# EasyEDA schematic schematic.json
TITLE: Portfolio Card; REV: 1.0; Date: 2025-05-03; Sheet: 1/1; Drawn By: Nico Brooks; Company: Nico Brooks
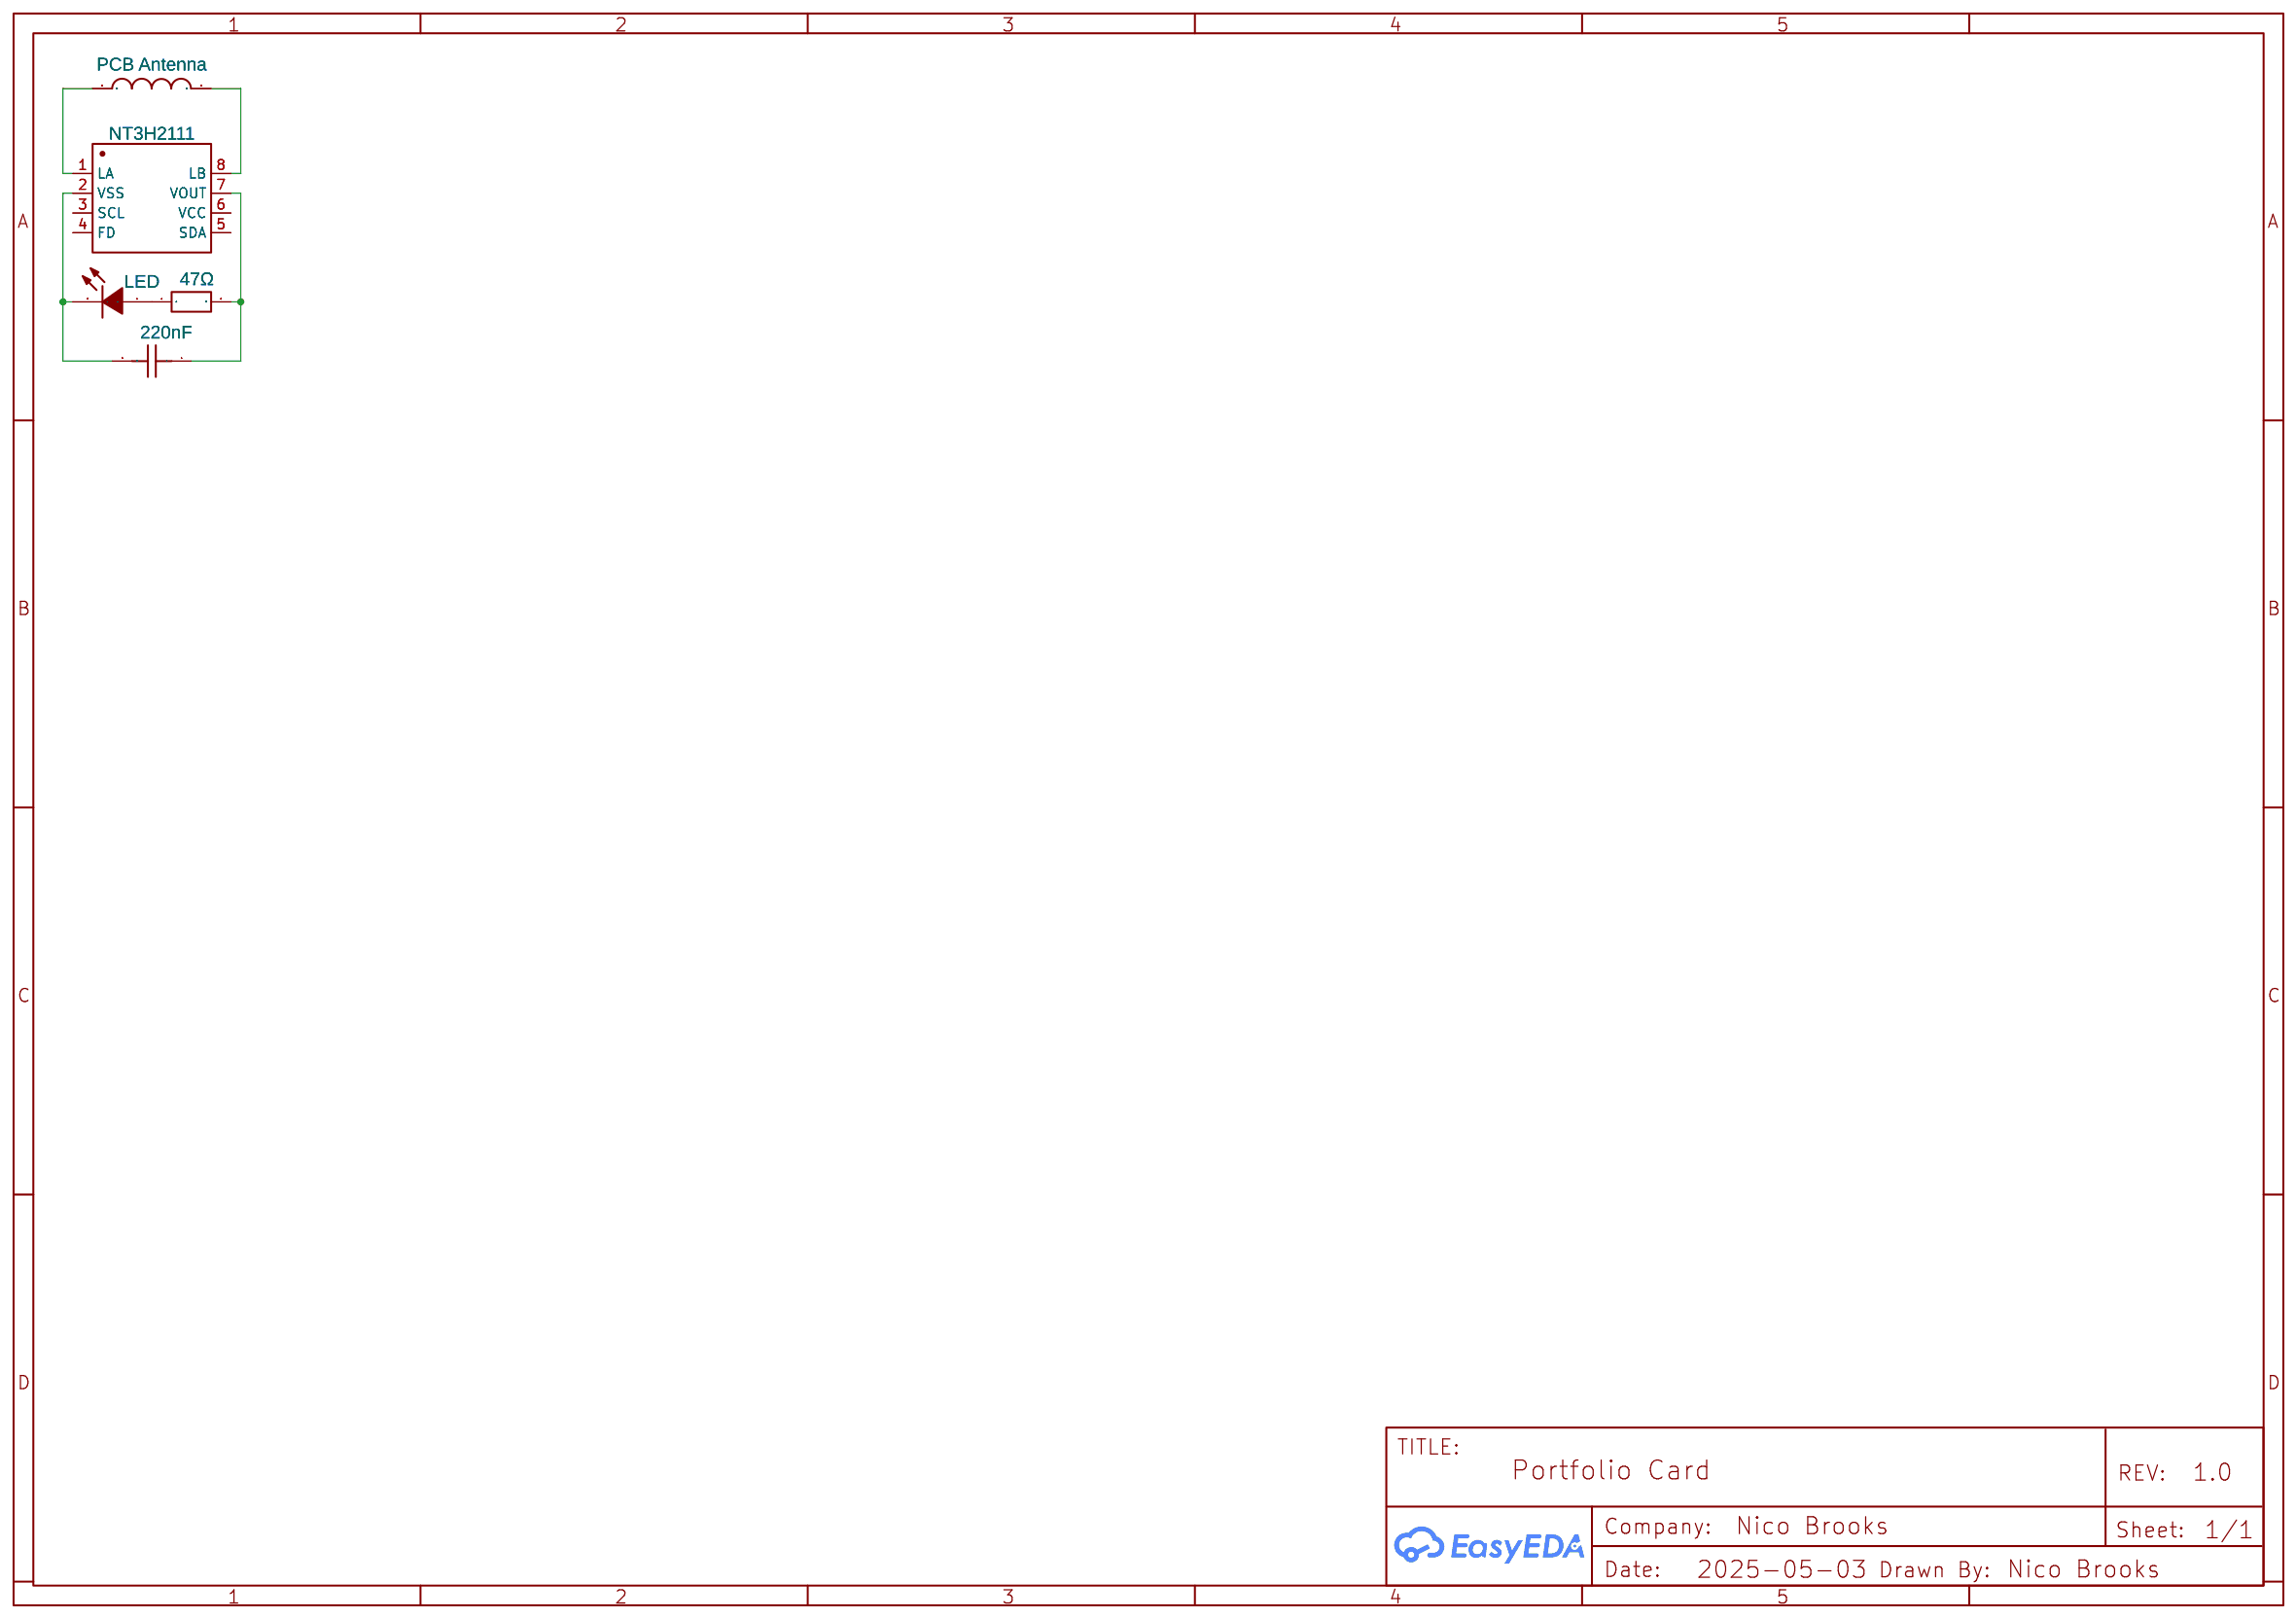
[diagram p0: schematic sheet]

## Parts
1  PCB Antenna  [25X48MM_NFC]
C1  220nF  [C0402]
LED  17-21SUYC/TR8  [LED0805-R-RD]
R2  47Ω  [R0805]
U1  NT3H2111  [XQFN-8_L1.6-W1.6-P0.50-BL_NT3H2111W0FHKH]

## Library data of the parts
1 = 25X48MM_NFC_ANTENNA: Contributor: barleybobs
C1 = CL05A224KQ5NNNC: Contributor: LCSC; Supplier: LCSC; Supplier Part: C307417; Manufacturer: SAMSUNG(三星); JLCPCB Part Class: Extended Part
LED = 17-21SUYC/TR8: Supplier: LCSC; Manufacturer: KENTO; Manufacturer Part: KT-0805黄灯; Supplier Part: C2296; JLCPCB Part Class: Basic Part
R2 = CR0805J47R0P05Z: Contributor: LCSC; Supplier: LCSC; Supplier Part: C881156; Manufacturer: EVER OHMS(天二科技); JLCPCB Part Class: Extended Part
U1 = NT3H2111W0FHKH: Contributor: LCSC; Supplier: LCSC; Supplier Part: C710403; Manufacturer: NXP(恩智浦); JLCPCB Part Class: Extended Part

## Nets
Net-(1-P$1): 1.P$1 U1.1(LA)
Net-(1-P$2): 1.P$2 U1.8(LB)
Net-(C1-1): C1.1 R2.2 U1.7(VOUT)
Net-(C1-2): C1.2 LED.2(-) U1.2(VSS)
Net-(LED-1): LED.1(+) R2.1

Not connected (* = marked no-connect by the designer): U1 3(SCL) 4(FD) 5(SDA) 6(VCC)
